# EAGLE design followLineMain (EAGLE 7.7.0)
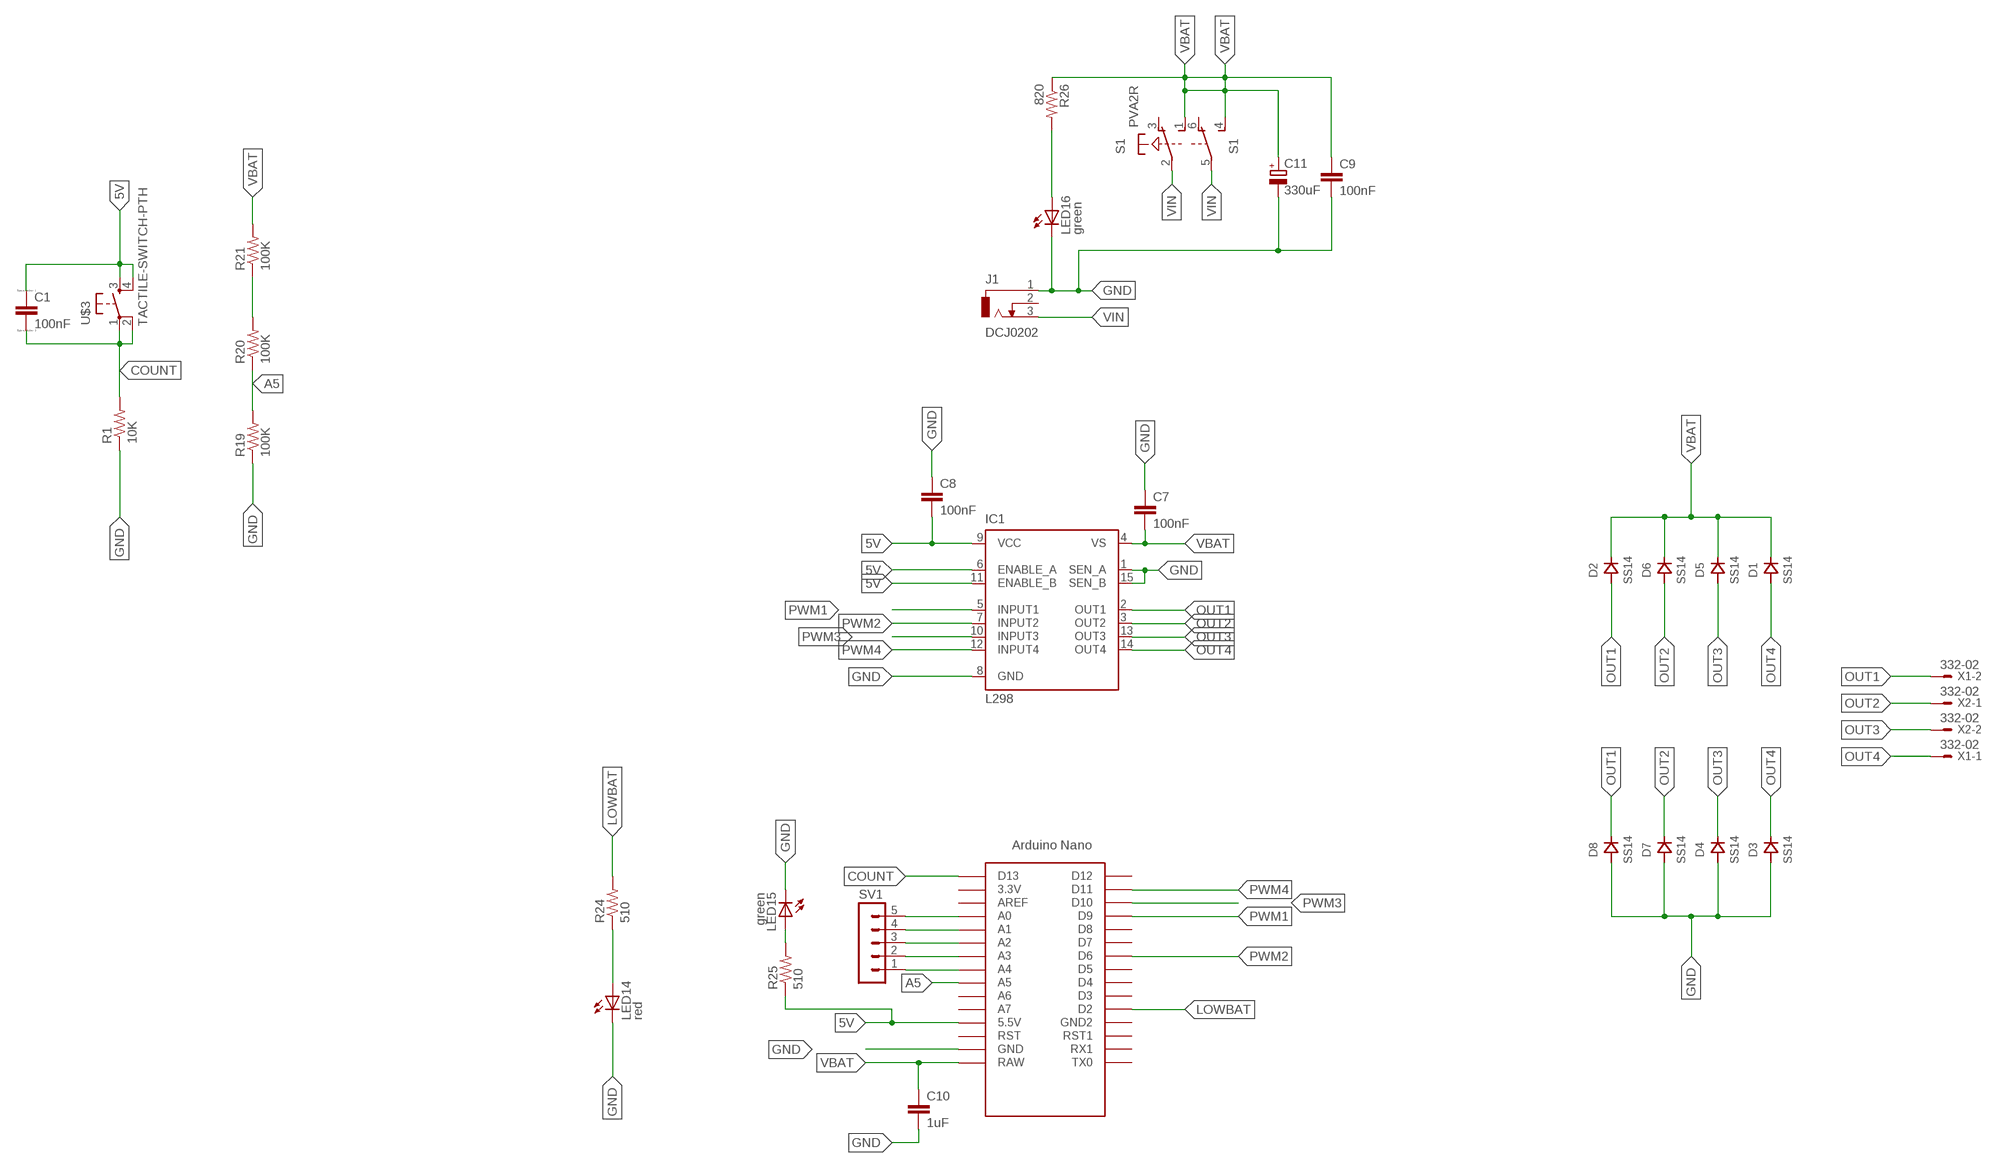
[diagram p0: schematic, sheet 1]

## Parts
C1  100nF  CC0603  [C0603]
C7  100nF  CAP0805  [0805]
C8  100nF  CAP0805  [0805]
C9  100nF  CAP0805  [0805]
C10  1uF  CAP1206  [1206]
C11  330uF  CPOL-EUE5-13  [E5-13]
D1  SS14  [DO214]
D2  SS14  [DO214]
D3  SS14  [DO214]
D4  SS14  [DO214]
D5  SS14  [DO214]
D6  SS14  [DO214]
D7  SS14  [DO214]
D8  SS14  [DO214]
IC1  L298  [MULTIWATT-15]
J1  DCJ0202  [DCJ0202]
LED14  red  LEDSML0805  [SML0805]
LED15  green  LEDSML0805  [SML0805]
LED16  green  LEDSML0805  [SML0805]
R1  10K  RESISTOR0805-RES  [0805]
R19  100K  RESISTOR0805-RES  [0805]
R20  100K  RESISTOR0805-RES  [0805]
R21  100K  RESISTOR0805-RES  [0805]
R24  510  RESISTOR0805-RES  [0805]
R25  510  RESISTOR0805-RES  [0805]
R26  820  RESISTOR0805-RES  [0805]
S1  PVA2R  [PVA2R]
SV1  MA05-1  [MA05-1]
U$1  NANO  [NANO]
U$3  TACTILE-SWITCH-PTH  [TAC-SWITCH-PTH]
X1  332-02  [332-02]
X2  332-02  [332-02]

## Nets
5V: C1.1 C8.2 IC1.6(ENABLE_A) IC1.9(VCC) IC1.11(ENABLE_B) R25.1 U$1.5V(5.5V) U$3.3 U$3.4
A5: R19.2 R20.1 U$1.A5
COUNT: C1.2 R1.2 U$1.D13 U$3.1 U$3.2
GND: C7.1 C8.1 C9.2 C10.2 C11.- D3.ANODE D4.ANODE D7.ANODE D8.ANODE IC1.1(SEN_A) IC1.8(GND) IC1.15(SEN_B) J1.1 LED14.C LED15.C LED16.C R1.1 R19.1 U$1.GND
LOWBAT: R24.2 U$1.D2
N$1: LED16.A R26.2
N$2: LED14.A R24.1
N$3: SV1.1 U$1.A4
N$4: SV1.2 U$1.A3
N$5: R20.2 R21.1
N$6: SV1.3 U$1.A2
N$7: SV1.4 U$1.A1
N$8: SV1.5 U$1.A0
N$9: LED15.A R25.2
OUT1: D2.ANODE D8.CATHODE IC1.2(OUT1) X1.2
OUT2: D6.ANODE D7.CATHODE IC1.3(OUT2) X2.1
OUT3: D4.CATHODE D5.ANODE IC1.13(OUT3) X2.2
OUT4: D1.ANODE D3.CATHODE IC1.14(OUT4) X1.1
PWM1: IC1.5(INPUT1) U$1.D9
PWM2: IC1.7(INPUT2) U$1.D6
PWM3: IC1.10(INPUT3) U$1.D10
PWM4: IC1.12(INPUT4) U$1.D11
VBAT: C7.2 C9.1 C10.1 C11.+ D1.CATHODE D2.CATHODE D5.CATHODE D6.CATHODE IC1.4(VS) R21.2 R26.1 S1.1(1:S) S1.4(2:S) U$1.RAW
VIN: J1.3 S1.2(1:P) S1.5(2:P)
Unconnected: J1.2 S1.3(1:O) S1.6(2:O) U$1.3.3V U$1.A6 U$1.A7 U$1.AREF U$1.D3 U$1.D4 U$1.D5 U$1.D7 U$1.D8 U$1.D12 U$1.GND1(GND2) U$1.ICSP1 U$1.ICSP2 U$1.ICSP3 U$1.ICSP4 U$1.ICSP5 U$1.ICSP6 U$1.RST U$1.RST1 U$1.RX1 U$1.TX0

## Library data of the parts
C1 = eagle-ltspice:C: CAPACITOR, European symbol; SPICEMODEL: NONE; SPICEPREFIX: C
C7-C10 = SparkFun-Capacitors:CAP: Capacitor Standard 0603 ceramic capacitor, and 0.1" leaded capacitor.
C11 = rcl:CPOL-EU: POLARIZED CAPACITOR, European symbol
D1-D8 = ihpcb-diode:SS14
IC1 = st-microelectronics:L298: DUAL FULL-BRIDGE DRIVER; MPN: L298N; OC_FARNELL: 1589425; OC_NEWARK: 32M1527
J1 = con-jack:DCJ0202: DC POWER JACK Source: DCJ0202.pdf; OC_FARNELL: unknown; OC_NEWARK: unknown
LED14-LED16 = led:LED: LED OSRAM: - CHIPLED LG R971, LG N971, LY N971, LG Q971, LY Q971, LO R971, LY R971 LH N974, LH R974 LS Q976, LO Q976, LY Q976 LO Q996 - Hyper CHIPLED LW Q18S LB Q993, LB Q99A, LB R99A - SideLED LS A670, LO A670, LY A670, LG A670, LP A670 LB A673, LV A673, LT A673, LW A673 LH A674 LY A675 LS A676, LA A676, LO A676, LY A676, LW A676 LS A679, LY A679, LG A679 - Hyper Micro SIDELED® LS Y876, LA Y876, LO Y876, LY Y876 LT Y87S - SmartLED LW L88C, LW L88S LB L89C, LB L89S, LG L890 LS L89K, LO L89K, LY L89K LS L896, LA L896, LO L896, LY L896 - TOPLED LS T670, LO T670, LY T670, LG T670, LP T670 LSG T670, LSP T670, LSY T670, LOP T670, LYG T670 LG T671, LOG T671, LSG T671 LB T673, LV T673, LT T673, LW T673 LH T674 LS T676, LA T676, LO T676, LY T676, LB T676, LH T676, LSB T676, LW T676 LB T67C, LV T67C, LT T67C, LS T67K, LO T67K, LY T67K, LW E67C LS E67B, LA E67B, LO E67B, LY E67B, LB E67C, LV E67C, LT E67C LW T67C LS T679, LY T679, LG T679 LS T770, LO T770, LY T770, LG T770, LP T770 LB T773, LV T773, LT T773, LW T773 LH T774 LS E675, LA E675, LY E675, LS T675 LS T776, LA T776, LO T776, LY T776, LB T776 LHGB T686 LT T68C, LB T68C - Hyper Mini TOPLED® LB M676 - Mini TOPLED Santana® LG M470 LS M47K, LO M47K, LY M47K Source: http://www.osram.convergy.de LUXEON: - LUMILED® LXK2-PW12-R00, LXK2-PW12-S00, LXK2-PW14-U00, LXK2-PW14-V00 LXK2-PM12-R00, LXK2-PM12-S00, LXK2-PM14-U00 LXK2-PE12-Q00, LXK2-PE12-R00, LXK2-PE12-S00, LXK2-PE14-T00, LXK2-PE14-U00 LXK2-PB12-K00, LXK2-PB12-L00, LXK2-PB12-M00, LXK2-PB14-N00, LXK2-PB14-P00, LXK2-PB14-Q00 LXK2-PR12-L00, LXK2-PR12-M00, LXK2-PR14-Q00, LXK2-PR14-R00 LXK2-PD12-Q00, LXK2-PD12-R00, LXK2-PD12-S00 LXK2-PH12-R00, LXK2-PH12-S00 LXK2-PL12-P00, LXK2-PL12-Q00, LXK2-PL12-R00 Source: www.luxeon.com KINGBRIGHT: KA-3528ASYC Source: www.kingbright.com
R1 R19-R21 R24-R26 = SparkFun-Passives:RESISTOR: Resistor Basic schematic elements and footprints for 0603, 1206, and PTH resistors.
S1 = switch-misc:PVA2R: ITT SWITCH
SV1 = con-lstb:MA05-1: PIN HEADER; OC_FARNELL: unknown; OC_NEWARK: unknown
U$1 = Arduino-clone:NANO: Arduino Nano
U$3 = GeekAmmo:TACTILE-SWITCH: Tactile Switch 4 Pins, SPST NO
X1 X2 = con-garry:332-02: 2 Pin - 2mm Dual Row Source: www.mpe-connector.de / garry_shortform_2012.pdf

## Board
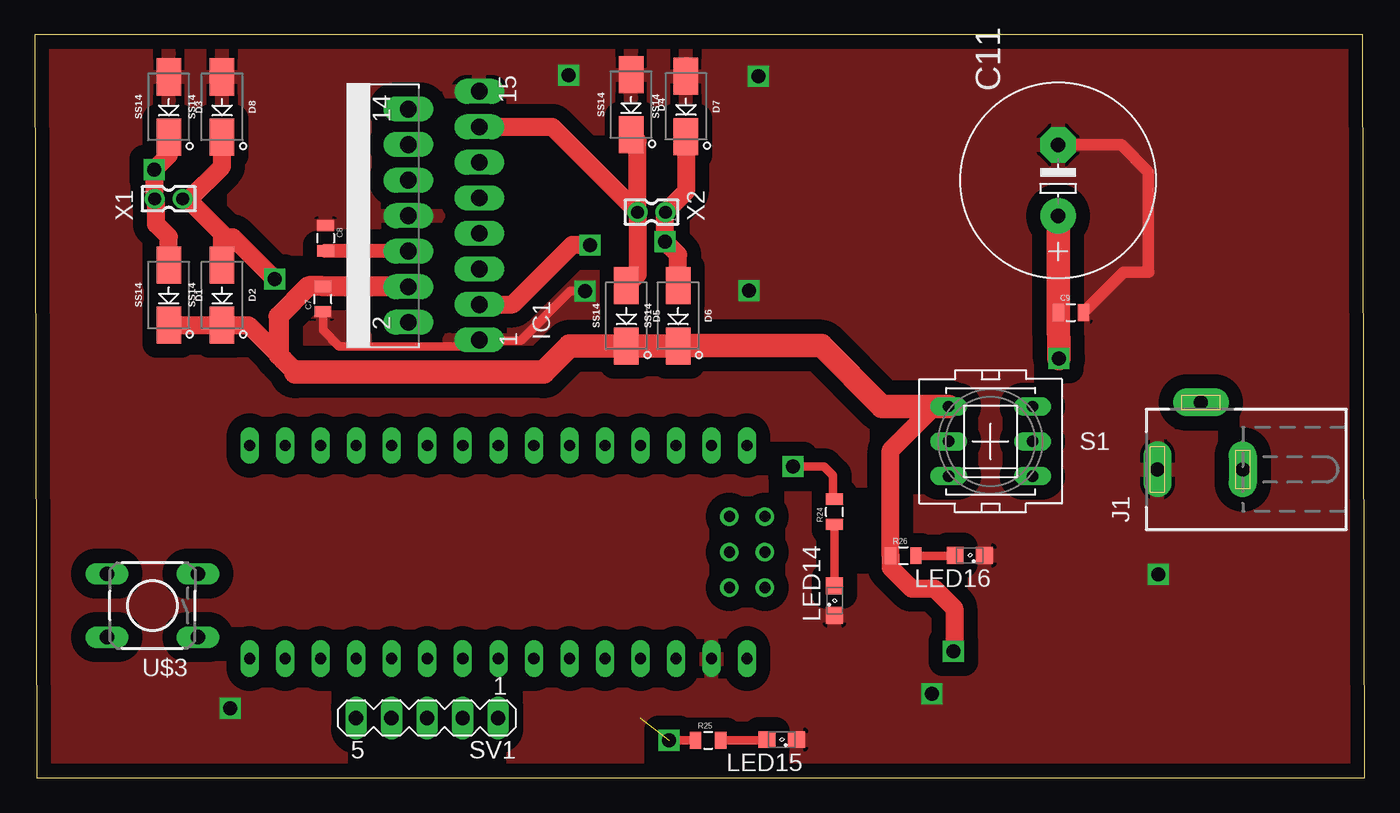
[diagram p1: board, top side]
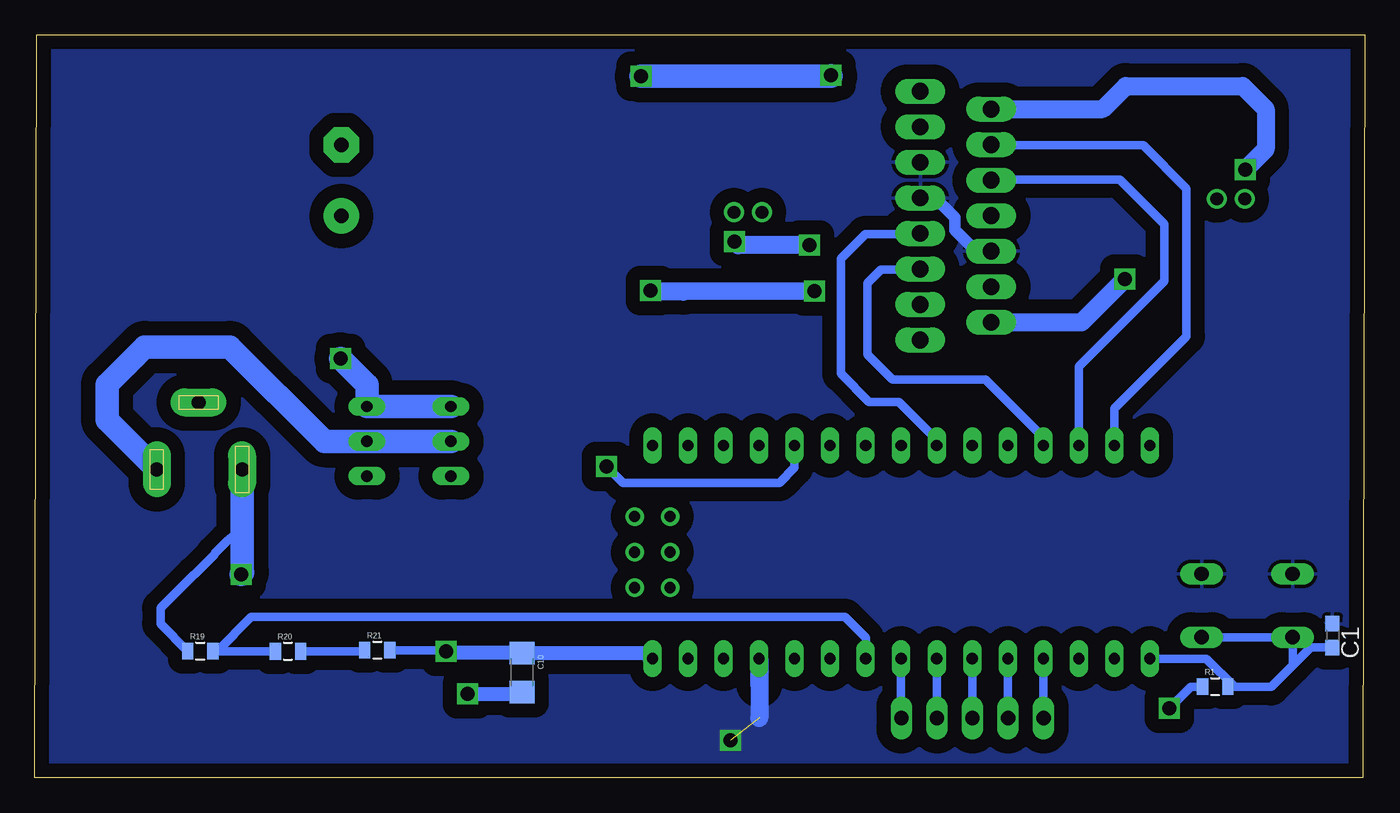
[diagram p2: board, bottom side, seen from below]

Size 95.03 x 53.11 mm. Coordinates in mm from the lower left corner, seen from the top.
Outline: 0.11,0 95.03,0 94.92,53.11 0,53.11 0.11,0
Copper layers (1*16): Top 0.035mm / dielectric 1.5mm / Bottom 0.035mm
Design rules "default": minimum track width 10mil, minimum drill 24mil, track to track 8mil, track to pad 8mil, pad to pad 8mil, via to via 8mil, smd to smd 8mil, copper to edge 40mil, drill to drill 8mil, minimum pad ring 10mil, minimum via ring 8mil, stop-mask expansion 4mil, vias tented up to drill 0mil, thermal gap 10mil

### Footprints (pad centres in the part's own frame; a part is rotated, then mirrored left to right if it is on the bottom)
C0603 = smd 1.1 x 1: 1 -0.85,0; 2 0.85,0
0805 = smd 0.8 x 1.2: 1 -0.9,0; 2 0.9,0
1206 = smd 1.6 x 1.8: 1 -1.4,0; 2 1.4,0
E5-13 = drill 1.016 pad 2.54: + -2.54,0 | drill 1.016 pad 2.54 octagon: - 2.54,0
DO214 = smd 2.65 x 1.75: ANODE -2.15,0; CATHODE 2.15,0
MULTIWATT-15 = drill 1.2 long: 1 -8.89,-7.62; 2 -7.62,-2.54; 3 -6.35,-7.62; 4 -5.08,-2.54; 5 -3.81,-7.62; 6 -2.54,-2.54; 7 -1.27,-7.62; 8 0,-2.54; 9 1.27,-7.62; 10 2.54,-2.54; 11 3.81,-7.62; 12 5.08,-2.54; 13 6.35,-7.62; 14 7.62,-2.54; 15 8.89,-7.62
DCJ0202 = drill 1 pad 2 long: 1 0,3.1; 2 4.8,0; 3 0,-3
SML0805 = smd 1.2 x 1.2: A 1.05,0; C -1.05,0
PVA2R = drill 0.813 long: 1 -2.997,2.489; 2 -2.997,0; 3 -2.997,-2.489; 4 2.997,2.489; 5 2.997,0; 6 2.997,-2.489
MA05-1 = drill 1.016 long: 1 -5.08,0; 2 -2.54,0; 3 0,0; 4 2.54,0; 5 5.08,0
NANO = drill 0.8 long: 3.3V -10.16,24.13; 5V -10.16,-1.27; A0 -10.16,19.05; A1 -10.16,16.51; A2 -10.16,13.97; A3 -10.16,11.43; A4 -10.16,8.89; A5 -10.16,6.35; A6 -10.16,3.81; A7 -10.16,1.27; AREF -10.16,21.59; D2 5.08,1.27; D3 5.08,3.81; D4 5.08,6.35; D5 5.08,8.89; D6 5.08,11.43; D7 5.08,13.97; D8 5.08,16.51; D9 5.08,19.05; D10 5.08,21.59; D11 5.08,24.13; D12 5.08,26.67; D13 -10.16,26.67; GND -10.16,-6.35; GND1 5.08,-1.27; RAW -10.16,-8.89; RST -10.16,-3.81; RST1 5.08,-3.81; RX1 5.08,-6.35; TX0 5.08,-8.89 | drill 0.8: ICSP1 -5.08,-10.16; ICSP2 -5.08,-7.62; ICSP3 -2.54,-10.16; ICSP4 -2.54,-7.62; ICSP5 0,-10.16; ICSP6 0,-7.62
TAC-SWITCH-PTH = drill 1.016 pad 1.524 long: 1 -3.251,2.261; 2 3.251,2.261; 3 -3.251,-2.261; 4 3.251,-2.261
332-02 = drill 0.9 pad 1.27: 1 0,-1; 2 0,1

### Placement (x,y rotation side)
C1  2.29,10.17 270 bottom
C7  20.58,34.24 90 top
C8  20.77,38.58 270 top
C9  74.04,33.27 0 top
C10  60.21,7.53 270 bottom
C11  73.13,42.71 90 top
D1  9.56,34.51 270 top
D2  13.37,34.51 270 top
D3  9.56,47.96 270 top
D4  42.61,48.12 270 top
D5  42.27,33.03 270 top
D6  45.97,33.03 270 top
D7  46.53,48 270 top
D8  13.37,47.96 270 top
IC1  24.14,40.19 90 top
J1  83.33,22.05 90 top
LED14  57.15,12.67 90 top
LED15  53.38,2.73 180 top
LED16  66.82,15.9 180 top
R1  10.68,6.52 0 bottom
R19  83.21,9.06 0 bottom
R20  76.95,9.05 0 bottom
R21  70.56,9.13 0 bottom
R24  57.15,19.02 90 top
R25  48.12,2.68 0 top
R26  62.06,15.88 0 top
S1  68.3,24.06 0 top
SV1  28.02,4.28 180 top
U$1  42.01,18.68 90 top
U$3  8.39,12.32 180 top
X1  9.56,41.4 270 top
X2  44.07,40.44 90 top

### Tracks (layer width: path | path; a pad name or v marks a point on that pad's centre or on a via)
5V  (via drill 1)  (1 unrouted)
  Top 0.61: R25.1 v45.33,2.68 v45.32,2.69
  Top 1.016: C8.2 26.65,37.68 IC1.6
  Bottom 0.813: IC1.9 30.68,41.46 29.28,40.06 29.28,39.16 28.04,37.92 27.99,37.92 27.69,37.62 26.71,37.62 IC1.6
  Bottom 1.27: U$1.5V 43.25,8.52 43.25,4.28
  pour Bottom (isolate 1.016): 0.44,52.61 94.52,52.61 94.74,-0.15 0.66,-0.15
A5
  Bottom 0.61: R19.2 82.02,9.05 | R20.1 82.02,9.05 | 82.02,9.05 79.57,11.5 37.14,11.5 35.64,10 35.64,8.54 U$1.A5
COUNT
  Bottom 0.61: U$3.1 U$3.2 5.14,8.03 | 5.14,8.03 6.67,6.5 9.27,6.5 | 9.27,6.5 9.76,6.5 R1.2 | C1.2 3.85,9.32 5.14,8.03 | U$1.D13 11.29,8.52 9.27,6.5
GND  (via drill 1)
  Top 0.61: v39.33,34.8 38.24,34.8 34.75,31.26 31.8,31.26 IC1.1 31.3,30.84 21.74,30.84 20.58,32 C7.1
  Top 0.813: C11.- 77.64,45.25 79.58,43.31 79.58,36.22 79.63,36.17 77.84,36.17 C9.2
  Top 1.016: 46.54,51.05 D7.ANODE
  Bottom 0.61: R1.1 12.4,6.52 v13.96,4.96 | R19.1 86.06,11.01 86.06,12.14 83.64,14.56 83.62,14.56 82.19,15.99 82.19,16.04 81.27,16.96 81.24,16.96 80.8,17.4 80.33,17.4 80.23,17.5
  Bottom 1.016: v64.1,5.99 60.21,5.99 C10.2
  Bottom 1.27: v39.33,34.8 48.68,34.75 48.68,34.78 51.05,34.78 v51.05,34.82
  Bottom 1.676: J1.1 80.23,17.5 80.23,14.74 80.18,14.69 v80.31,14.56 | v51.72,50.16 38.12,50.16 38.12,50.19
  other vias: 38.12,50.24
  pour Top (isolate 1.016): 1.08,53.73 94.52,53.73 94.2,0.77 0.76,0.77
LOWBAT  (via drill 1)
  Top 0.61: v54.18,22.26 56.4,22.26 57.05,21.61 57.05,20.02 R24.2
  Bottom 0.61: U$1.D2 40.74,22.18 41.83,21.09 53.01,21.09 v54.18,22.26
N$1
  Top 0.61: R26.2 65.75,15.88 LED16.A
N$2
  Top 0.61: R24.1 LED14.A
N$3
  Bottom 0.61: SV1.1 33.12,4.28 U$1.A4
N$4
  Bottom 0.61: SV1.2 30.58,4.28 U$1.A3
N$5
  Bottom 0.61: 71.53,9.06 R21.1 71.54,9.05 R20.2
N$6
  Bottom 0.61: SV1.3 28.04,4.28 U$1.A2
N$7
  Bottom 0.61: SV1.4 25.5,4.28 U$1.A1
N$8
  Bottom 0.61: SV1.5 22.96,4.28 U$1.A0
N$9
  Top 0.61: R25.2 52.28,2.68 LED15.A
N$14
  Bottom 1.27: 43.31,8.47 43.28,8.47 43.28,6.67
OUT1  (via drill 1)
  Top 1.016: 13.39,45.79 D8.CATHODE
  Top 1.27: X1.2 11.06,41.4 | 11.06,41.4 13.37,43.71 D8.CATHODE | 11.06,41.4 11.06,41.22 13.33,38.95 | 13.33,38.95 13.33,36.7 D2.ANODE | v17.13,35.66 v17.12,35.66 14.15,38.63 13.65,38.63 13.33,38.95
  Top 1.422: 13.34,45.78 D8.CATHODE
  Bottom 1.27: IC1.2 20.22,32.57 v17.13,35.66
OUT2  (via drill 1)
  Top 1.27: D7.CATHODE 46.53,41.9 X2.1 45.03,40.4 v45.03,38.34 45.97,37.4 D6.ANODE | IC1.3 34.14,33.84 38.41,38.11 39.65,38.11 v39.69,38.07
  Bottom 1.27: v39.69,38.07 44.76,38.07 v45.03,38.34
OUT3
  Top 1.27: X2.2 43.07,35.98 D5.ANODE | X2.2 43.07,45.51 D4.CATHODE | IC1.13 36.97,46.54 X2.2
OUT4  (via drill 1)
  Top 1.016: 8.59,41.37 X1.1
  Top 1.27: D1.ANODE 9.56,38.68 8.66,39.58 8.66,41.3 X1.1 8.52,41.44 v8.52,43.49 9.56,44.53 D3.CATHODE
  Bottom 1.27: IC1.14 18.71,47.81 17.06,49.46 8.71,49.46 7.07,47.82 7.07,44.94 v8.52,43.49
PWM1
  Bottom 0.61: U$1.D9 22.96,24.33 27.09,28.46 33.74,28.46 35.53,30.25 35.53,35.37 34.55,36.35 31.79,36.35 IC1.5
PWM2
  Bottom 0.61: U$1.D6 30.58,24.17 33.29,26.88 35.42,26.88 37.43,28.89 37.43,37.12 35.69,38.86 31.82,38.86 IC1.7
PWM3
  Bottom 0.61: U$1.D10 20.42,29.39 14.3,35.51 14.3,39.57 17.5,42.77 26.64,42.77 IC1.10
PWM4
  Bottom 0.61: U$1.D11 17.88,26.4 12.72,31.56 12.72,42.14 15.8,45.22 26.63,45.22 IC1.12
VBAT  (via drill 1)
  Top 1.016: 26.65,35.14 IC1.4
  Top 1.27: D1.CATHODE D2.CATHODE 15.27,32.36 17.4,30.23 17.74,29.89 | 64.3,26.55 61.16,23.41 R26.1 61.16,15.04 62.66,13.54 64.29,13.54 65.7,12.13 65.7,9.1 v65.65,9.05
  Top 1.422: 26.65,35.14 C7.2 19.56,35.14 17.4,32.98 17.4,30.23 | 17.74,29.89 18.63,29
  Top 1.676: v73.19,29.98 C9.1 73.14,36.24 C11.+ | S1.1 64.3,26.55 60.54,26.55 56.2,30.89 D6.CATHODE D5.CATHODE 38.22,30.88 36.34,29 18.63,29
  Bottom 0.61: R21.2 65.73,9.13 v65.65,9.05
  Bottom 1.016: v65.65,9.05 65.65,8.93 C10.1 51.31,8.93 U$1.RAW
  Bottom 1.27: 50.96,8.46 U$1.RAW
  Bottom 1.676: S1.1 S1.4 71.3,28.09 v73.19,29.98
VIN
  Bottom 1.676: S1.2 S1.5 74.34,24.05 81.1,30.81 87.18,30.81 89.87,28.12 89.87,25.6 J1.3